# Altium schematic sheet SecondStageAmplifier.SchDoc
size A4; Author: Michał Kowalik; CompanyName: AGH; Engineer: dr inż. Piotr Otfinowski; DocumentNumber: 5; Revision: Rev; SheetNumber: 5; SheetTotal: 6; ProjectName: Project Name
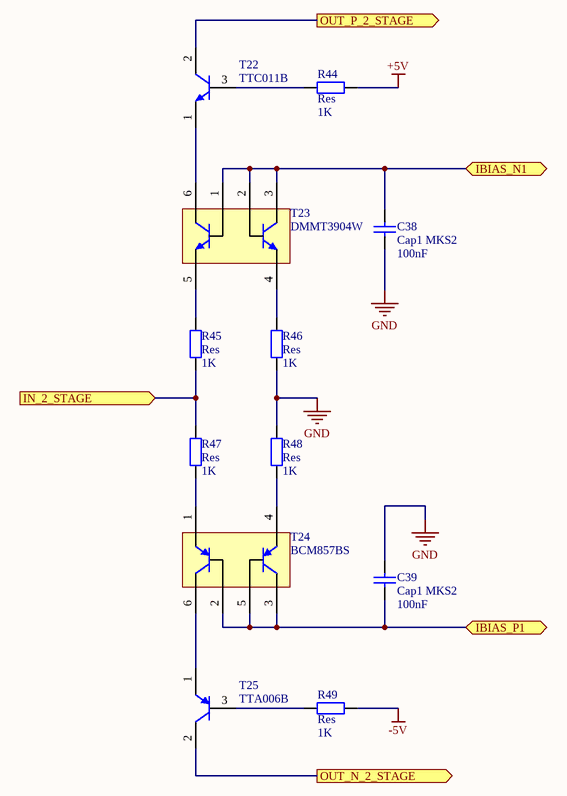
[diagram p0: SecondStageAmplifier.SchDoc]

## Parts
C38  Cap1 MKS2  value 100nF  [CAP-0.5-WIMA_MKS2]
C39  Cap1 MKS2  value 100nF  [CAP-0.5-WIMA_MKS2]
R44  Res  value 1K  [RESISTOR-10mm]
R45  Res  value 1K  [RESISTOR-10mm]
R46  Res  value 1K  [RESISTOR-10mm]
R47  Res  value 1K  [RESISTOR-10mm]
R48  Res  value 1K  [RESISTOR-10mm]
R49  Res  value 1K  [RESISTOR-10mm]
T22  TTC011B  [TO-126]
T23  DMMT3904W  [SOT363_IPC_MD]
T24  BCM857BS  [SOT363_IPC_MD]
T25  TTA006B  [TO-126]

## Ports
IBIAS_N1 (bidir), IBIAS_P1 (bidir), IN_2_STAGE (in), OUT_N_2_STAGE (out), OUT_P_2_STAGE (out)

## Nets
+5V: R44.2
-5V: R49.2
GND: C38.1 C39.2 R46.1 R48.2
IBIAS_N1: C38.2 T23.1(B1) T23.2(B2) T23.3(C2) ; port IBIAS_N1
IBIAS_P1: C39.1 T24.2(B1) T24.3(E2) T24.5(B2) ; port IBIAS_P1
IN_2_STAGE: R45.1 R47.2 ; port IN_2_STAGE
OUT_N_2_STAGE: T25.2(C) ; port OUT_N_2_STAGE
OUT_P_2_STAGE: T22.2(C) ; port OUT_P_2_STAGE
NetR44_1: R44.1 T22.3(B)
NetR45_2: R45.2 T23.5(E1)
NetR46_2: R46.2 T23.4(E2)
NetR47_1: R47.1 T24.1(C1)
NetR48_1: R48.1 T24.4(C2)
NetR49_1: R49.1 T25.3(B)
NetT22_1: T22.1(E) T23.6(C1)
NetT24_6: T24.6(E1) T25.1(E)

## Notes on the sheet
- Document name:
- Project name:
- Author:
- Date/Time:
- Sheet:
- Revision:
- of
- Designer:

## Library data of the parts
C38 C39 = Cap1: WIMA MKS2 Metallized Polyester (PET) / Capacitors in PCM 5 mm
R44-R49 = Res: Resistor
T22 = TTC011B: NPN High Voltage Transistor; ComponentLink1Description: Manufacturer Link; ComponentLink1URL: http://www.fairchildsemi.com/; ComponentLink2Description: Datasheet; ComponentLink2URL: http://www.fairchildsemi.com/ds/2N%2F2N3904.pdf
T23 = DMMT3904W: 40V MATCHED PAIR NPN SMALL SIGNAL TRANSISTOR
T24 = BCM857BS: 40V MATCHED PAIR NPN SMALL SIGNAL TRANSISTOR
T25 = TTA006B: PNP High Voltage Transistor; ComponentLink1Description: Manufacturer Link; ComponentLink1URL: http://www.fairchildsemi.com/; ComponentLink2Description: Datasheet; ComponentLink2URL: http://www.fairchildsemi.com/ds/2N%2F2N3906.pdf